# Altium schematic sheet Connector_SOM240_2.SchDoc: =SheetTitle_Top
size 420 x 297 mm; EDA_Number: ARTIQ; Author: G.Kasprowicz; CompanyName: WUT ISE; DrawnBy: G.Kasprowicz; Organization: WUT ISE; Address1: PW ISE; Address2: Nowowiejska 15/19 00-665 Warsaw; Address3: gkasprow@gmail.com; ModifiedBy: -; CheckedDate: -; Title2: K26 SOM240_2 Connector; DivGrp: WUT ISE; Designer: G.Kasprowicz; ModifiedDate: -; ProjectName: Sensor Box
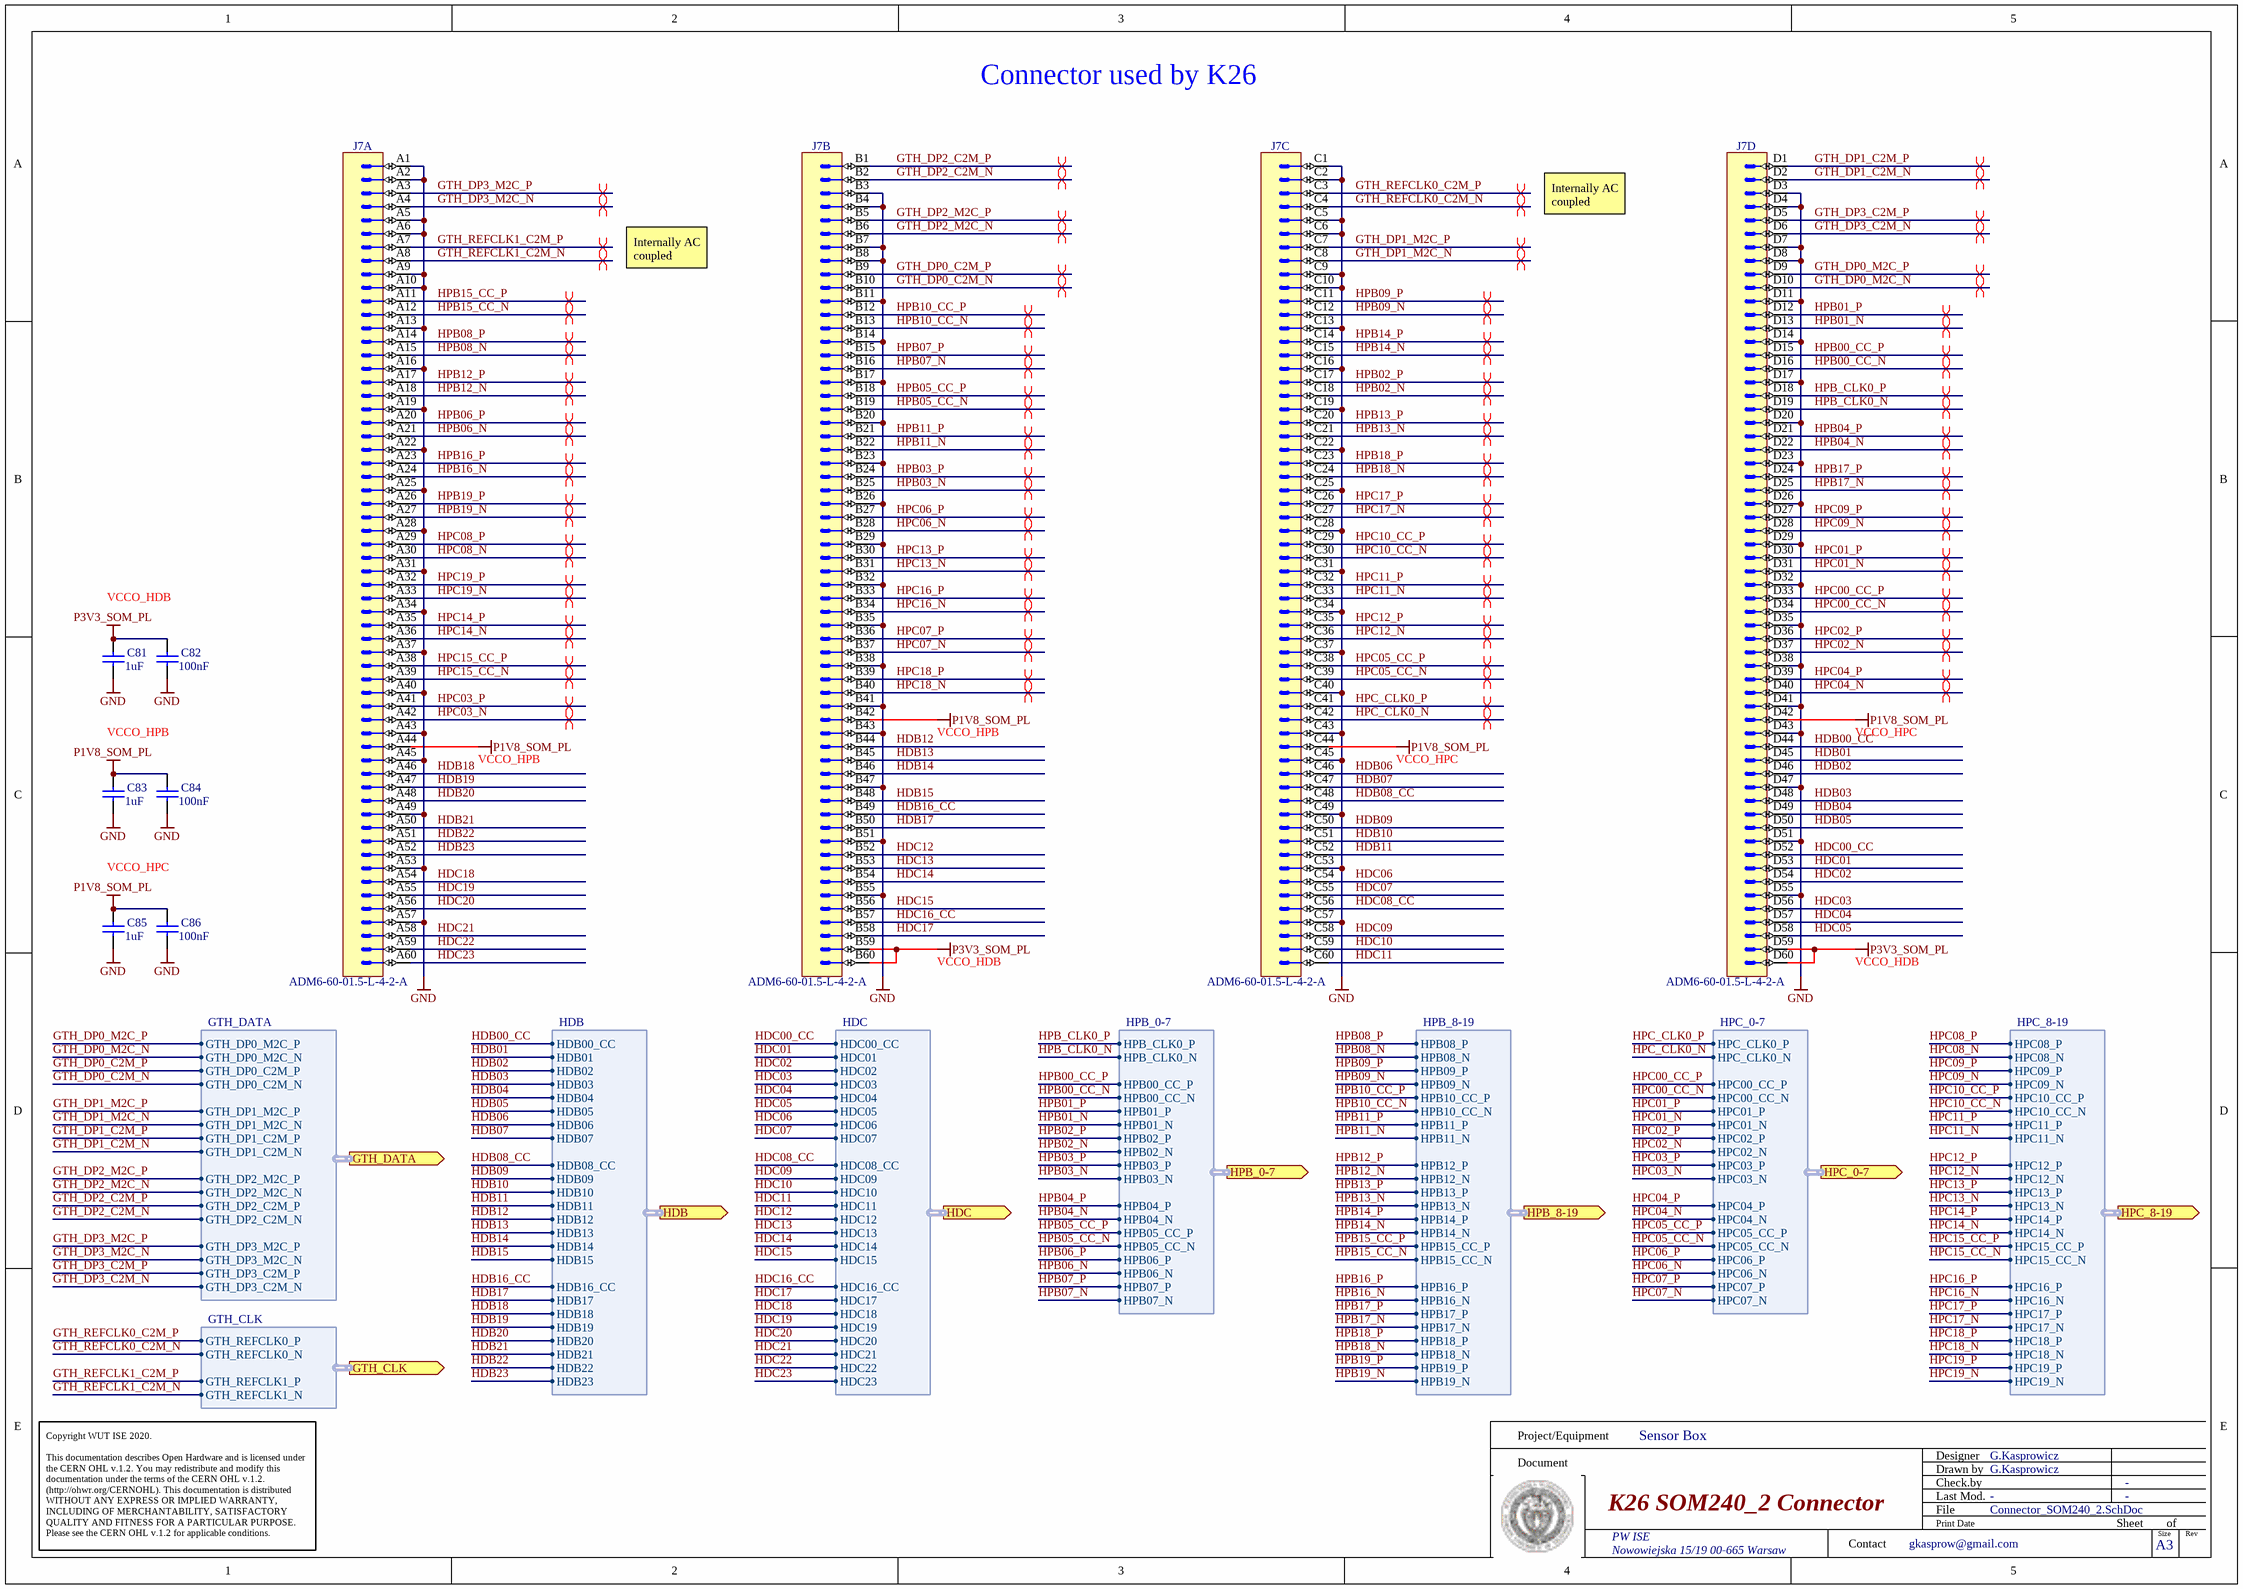
[diagram p0: Connector_SOM240_2.SchDoc]

## Parts
C81  1uF  [CAPC1005X55N]
C82  100nF  [CAPC1005X55N]
C83  1uF  [CAPC1005X55N]
C84  100nF  [CAPC1005X55N]
C85  1uF  [CAPC1005X55N]
C86  100nF  [CAPC1005X55N]
J7  Manufacturer Part Number: ADM6-60-01.5-L-4-2-A  [SAMTEC_ADM6-60-01.5-L-4-2-A]  (hidden comment: Header 240)  (parts A,B,C,D of 4)

## Ports
GTH_CLK (out, harness GTH_CLK), GTH_DATA (out, harness GTH_DATA), HDB (out, harness HDB), HDC (out, harness HDC), HPB_0-7 (out, harness HPB_0-7), HPB_8-19 (out, harness HPB_8-19), HPC_0-7 (out, harness HPC_0-7), HPC_8-19 (out, harness HPC_8-19)

## Harnesses
HDC: HDC00_CC, HDC01, HDC02, HDC03, HDC04, HDC05, HDC06, HDC07, HDC08_CC, HDC09, HDC10, HDC11, HDC12, HDC13, HDC14, HDC15, HDC16_CC, HDC17, HDC18, HDC19, HDC20, HDC21, HDC22, HDC23
HDB: HDB00_CC, HDB01, HDB02, HDB03, HDB04, HDB05, HDB06, HDB07, HDB08_CC, HDB09, HDB10, HDB11, HDB12, HDB13, HDB14, HDB15, HDB16_CC, HDB17, HDB18, HDB19, HDB20, HDB21, HDB22, HDB23
GTH_DATA: GTH_DP0_M2C_P, GTH_DP0_M2C_N, GTH_DP0_C2M_P, GTH_DP0_C2M_N, GTH_DP1_M2C_P, GTH_DP1_M2C_N, GTH_DP1_C2M_P, GTH_DP1_C2M_N, GTH_DP2_M2C_P, GTH_DP2_M2C_N, GTH_DP2_C2M_P, GTH_DP2_C2M_N, GTH_DP3_M2C_P, GTH_DP3_M2C_N, GTH_DP3_C2M_P, GTH_DP3_C2M_N
GTH_CLK: GTH_REFCLK0_P, GTH_REFCLK0_N, GTH_REFCLK1_P, GTH_REFCLK1_N
HPB_0-7: HPB_CLK0_P, HPB_CLK0_N, HPB00_CC_P, HPB00_CC_N, HPB01_P, HPB01_N, HPB02_P, HPB02_N, HPB03_P, HPB03_N, HPB04_P, HPB04_N, HPB05_CC_P, HPB05_CC_N, HPB06_P, HPB06_N, HPB07_P, HPB07_N
HPB_8-19: HPB08_P, HPB08_N, HPB09_P, HPB09_N, HPB10_CC_P, HPB10_CC_N, HPB11_P, HPB11_N, HPB12_P, HPB12_N, HPB13_P, HPB13_N, HPB14_P, HPB14_N, HPB15_CC_P, HPB15_CC_N, HPB16_P, HPB16_N, HPB17_P, HPB17_N, HPB18_P, HPB18_N, HPB19_P, HPB19_N
HPC_0-7: HPC_CLK0_P, HPC_CLK0_N, HPC00_CC_P, HPC00_CC_N, HPC01_P, HPC01_N, HPC02_P, HPC02_N, HPC03_P, HPC03_N, HPC04_P, HPC04_N, HPC05_CC_P, HPC05_CC_N, HPC06_P, HPC06_N, HPC07_P, HPC07_N
HPC_8-19: HPC08_P, HPC08_N, HPC09_P, HPC09_N, HPC10_CC_P, HPC10_CC_N, HPC11_P, HPC11_N, HPC12_P, HPC12_N, HPC13_P, HPC13_N, HPC14_P, HPC14_N, HPC15_CC_P, HPC15_CC_N, HPC16_P, HPC16_N, HPC17_P, HPC17_N, HPC18_P, HPC18_N, HPC19_P, HPC19_N

## Nets
GND: C81.1 C82.1 C83.1 C84.1 C85.1 C86.1 J7.A1 J7.A2 J7.A5 J7.A6 J7.A9 J7.A10 J7.A13 J7.A16 J7.A19 J7.A22 J7.A25 J7.A28 J7.A31 J7.A34 J7.A37 J7.A40 J7.A43 J7.A45 J7.A49 J7.A53 J7.A57 J7.B3 J7.B4 J7.B7 J7.B8 J7.B11 J7.B14 J7.B17 J7.B20 J7.B23 J7.B26 J7.B29 J7.B32 J7.B35 J7.B38 J7.B41 J7.B43 J7.B47 J7.B51 J7.B55 J7.C1 J7.C2 J7.C5 J7.C6 J7.C9 J7.C10 J7.C13 J7.C16 J7.C19 J7.C22 J7.C25 J7.C28 J7.C31 J7.C34 J7.C37 J7.C40 J7.C43 J7.C45 J7.C49 J7.C53 J7.C57 J7.D3 J7.D4 J7.D7 J7.D8 J7.D11 J7.D14 J7.D17 J7.D20 J7.D23 J7.D26 J7.D29 J7.D32 J7.D35 J7.D38 J7.D41 J7.D43 J7.D47 J7.D51 J7.D55
P1V8_SOM_PL: C83.2 C84.2 C85.2 C86.2 J7.A44 J7.B42 J7.C44 J7.D42
P3V3_SOM_PL: C81.2 C82.2 J7.B59 J7.B60 J7.D59 J7.D60
GTH_DP0_C2M_N: J7.B10 ; port GTH_DATA.GTH_DP0_C2M_N
GTH_DP0_C2M_P: J7.B9 ; port GTH_DATA.GTH_DP0_C2M_P
GTH_DP0_M2C_N: J7.D10 ; port GTH_DATA.GTH_DP0_M2C_N
GTH_DP0_M2C_P: J7.D9 ; port GTH_DATA.GTH_DP0_M2C_P
GTH_DP1_C2M_N: J7.D2 ; port GTH_DATA.GTH_DP1_C2M_N
GTH_DP1_C2M_P: J7.D1 ; port GTH_DATA.GTH_DP1_C2M_P
GTH_DP1_M2C_N: J7.C8 ; port GTH_DATA.GTH_DP1_M2C_N
GTH_DP1_M2C_P: J7.C7 ; port GTH_DATA.GTH_DP1_M2C_P
GTH_DP2_C2M_N: J7.B2 ; port GTH_DATA.GTH_DP2_C2M_N
GTH_DP2_C2M_P: J7.B1 ; port GTH_DATA.GTH_DP2_C2M_P
GTH_DP2_M2C_N: J7.B6 ; port GTH_DATA.GTH_DP2_M2C_N
GTH_DP2_M2C_P: J7.B5 ; port GTH_DATA.GTH_DP2_M2C_P
GTH_DP3_C2M_N: J7.D6 ; port GTH_DATA.GTH_DP3_C2M_N
GTH_DP3_C2M_P: J7.D5 ; port GTH_DATA.GTH_DP3_C2M_P
GTH_DP3_M2C_N: J7.A4 ; port GTH_DATA.GTH_DP3_M2C_N
GTH_DP3_M2C_P: J7.A3 ; port GTH_DATA.GTH_DP3_M2C_P
GTH_REFCLK0_C2M_N: J7.C4 ; port GTH_CLK.GTH_REFCLK0_N
GTH_REFCLK0_C2M_P: J7.C3 ; port GTH_CLK.GTH_REFCLK0_P
GTH_REFCLK1_C2M_N: J7.A8 ; port GTH_CLK.GTH_REFCLK1_N
GTH_REFCLK1_C2M_P: J7.A7 ; port GTH_CLK.GTH_REFCLK1_P
HDB00_CC: J7.D44 ; port HDB.HDB00_CC
HDB01: J7.D45 ; port HDB.HDB01
HDB02: J7.D46 ; port HDB.HDB02
HDB03: J7.D48 ; port HDB.HDB03
HDB04: J7.D49 ; port HDB.HDB04
HDB05: J7.D50 ; port HDB.HDB05
HDB06: J7.C46 ; port HDB.HDB06
HDB07: J7.C47 ; port HDB.HDB07
HDB08_CC: J7.C48 ; port HDB.HDB08_CC
HDB09: J7.C50 ; port HDB.HDB09
HDB10: J7.C51 ; port HDB.HDB10
HDB11: J7.C52 ; port HDB.HDB11
HDB12: J7.B44 ; port HDB.HDB12
HDB13: J7.B45 ; port HDB.HDB13
HDB14: J7.B46 ; port HDB.HDB14
HDB15: J7.B48 ; port HDB.HDB15
HDB16_CC: J7.B49 ; port HDB.HDB16_CC
HDB17: J7.B50 ; port HDB.HDB17
HDB18: J7.A46 ; port HDB.HDB18
HDB19: J7.A47 ; port HDB.HDB19
HDB20: J7.A48 ; port HDB.HDB20
HDB21: J7.A50 ; port HDB.HDB21
HDB22: J7.A51 ; port HDB.HDB22
HDB23: J7.A52 ; port HDB.HDB23
HDC00_CC: J7.D52 ; port HDC.HDC00_CC
HDC01: J7.D53 ; port HDC.HDC01
HDC02: J7.D54 ; port HDC.HDC02
HDC03: J7.D56 ; port HDC.HDC03
HDC04: J7.D57 ; port HDC.HDC04
HDC05: J7.D58 ; port HDC.HDC05
HDC06: J7.C54 ; port HDC.HDC06
HDC07: J7.C55 ; port HDC.HDC07
HDC08_CC: J7.C56 ; port HDC.HDC08_CC
HDC09: J7.C58 ; port HDC.HDC09
HDC10: J7.C59 ; port HDC.HDC10
HDC11: J7.C60 ; port HDC.HDC11
HDC12: J7.B52 ; port HDC.HDC12
HDC13: J7.B53 ; port HDC.HDC13
HDC14: J7.B54 ; port HDC.HDC14
HDC15: J7.B56 ; port HDC.HDC15
HDC16_CC: J7.B57 ; port HDC.HDC16_CC
HDC17: J7.B58 ; port HDC.HDC17
HDC18: J7.A54 ; port HDC.HDC18
HDC19: J7.A55 ; port HDC.HDC19
HDC20: J7.A56 ; port HDC.HDC20
HDC21: J7.A58 ; port HDC.HDC21
HDC22: J7.A59 ; port HDC.HDC22
HDC23: J7.A60 ; port HDC.HDC23
HPB00_CC_N: J7.D16 ; port HPB_0-7.HPB00_CC_N
HPB00_CC_P: J7.D15 ; port HPB_0-7.HPB00_CC_P
HPB01_N: J7.D13 ; port HPB_0-7.HPB01_N
HPB01_P: J7.D12 ; port HPB_0-7.HPB01_P
HPB02_N: J7.C18 ; port HPB_0-7.HPB02_N
HPB02_P: J7.C17 ; port HPB_0-7.HPB02_P
HPB03_N: J7.B25 ; port HPB_0-7.HPB03_N
HPB03_P: J7.B24 ; port HPB_0-7.HPB03_P
HPB04_N: J7.D22 ; port HPB_0-7.HPB04_N
HPB04_P: J7.D21 ; port HPB_0-7.HPB04_P
HPB05_CC_N: J7.B19 ; port HPB_0-7.HPB05_CC_N
HPB05_CC_P: J7.B18 ; port HPB_0-7.HPB05_CC_P
HPB06_N: J7.A21 ; port HPB_0-7.HPB06_N
HPB06_P: J7.A20 ; port HPB_0-7.HPB06_P
HPB07_N: J7.B16 ; port HPB_0-7.HPB07_N
HPB07_P: J7.B15 ; port HPB_0-7.HPB07_P
HPB08_N: J7.A15 ; port HPB_8-19.HPB08_N
HPB08_P: J7.A14 ; port HPB_8-19.HPB08_P
HPB09_N: J7.C12 ; port HPB_8-19.HPB09_N
HPB09_P: J7.C11 ; port HPB_8-19.HPB09_P
HPB10_CC_N: J7.B13 ; port HPB_8-19.HPB10_CC_N
HPB10_CC_P: J7.B12 ; port HPB_8-19.HPB10_CC_P
HPB11_N: J7.B22 ; port HPB_8-19.HPB11_N
HPB11_P: J7.B21 ; port HPB_8-19.HPB11_P
HPB12_N: J7.A18 ; port HPB_8-19.HPB12_N
HPB12_P: J7.A17 ; port HPB_8-19.HPB12_P
HPB13_N: J7.C21 ; port HPB_8-19.HPB13_N
HPB13_P: J7.C20 ; port HPB_8-19.HPB13_P
HPB14_N: J7.C15 ; port HPB_8-19.HPB14_N
HPB14_P: J7.C14 ; port HPB_8-19.HPB14_P
HPB15_CC_N: J7.A12 ; port HPB_8-19.HPB15_CC_N
HPB15_CC_P: J7.A11 ; port HPB_8-19.HPB15_CC_P
HPB16_N: J7.A24 ; port HPB_8-19.HPB16_N
HPB16_P: J7.A23 ; port HPB_8-19.HPB16_P
HPB17_N: J7.D25 ; port HPB_8-19.HPB17_N
HPB17_P: J7.D24 ; port HPB_8-19.HPB17_P
HPB18_N: J7.C24 ; port HPB_8-19.HPB18_N
HPB18_P: J7.C23 ; port HPB_8-19.HPB18_P
HPB19_N: J7.A27 ; port HPB_8-19.HPB19_N
HPB19_P: J7.A26 ; port HPB_8-19.HPB19_P
HPB_CLK0_N: J7.D19 ; port HPB_0-7.HPB_CLK0_N
HPB_CLK0_P: J7.D18 ; port HPB_0-7.HPB_CLK0_P
HPC00_CC_N: J7.D34 ; port HPC_0-7.HPC00_CC_N
HPC00_CC_P: J7.D33 ; port HPC_0-7.HPC00_CC_P
HPC01_N: J7.D31 ; port HPC_0-7.HPC01_N
HPC01_P: J7.D30 ; port HPC_0-7.HPC01_P
HPC02_N: J7.D37 ; port HPC_0-7.HPC02_N
HPC02_P: J7.D36 ; port HPC_0-7.HPC02_P
HPC03_N: J7.A42 ; port HPC_0-7.HPC03_N
HPC03_P: J7.A41 ; port HPC_0-7.HPC03_P
HPC04_N: J7.D40 ; port HPC_0-7.HPC04_N
HPC04_P: J7.D39 ; port HPC_0-7.HPC04_P
HPC05_CC_N: J7.C39 ; port HPC_0-7.HPC05_CC_N
HPC05_CC_P: J7.C38 ; port HPC_0-7.HPC05_CC_P
HPC06_N: J7.B28 ; port HPC_0-7.HPC06_N
HPC06_P: J7.B27 ; port HPC_0-7.HPC06_P
HPC07_N: J7.B37 ; port HPC_0-7.HPC07_N
HPC07_P: J7.B36 ; port HPC_0-7.HPC07_P
HPC08_N: J7.A30 ; port HPC_8-19.HPC08_N
HPC08_P: J7.A29 ; port HPC_8-19.HPC08_P
HPC09_N: J7.D28 ; port HPC_8-19.HPC09_N
HPC09_P: J7.D27 ; port HPC_8-19.HPC09_P
HPC10_CC_N: J7.C30 ; port HPC_8-19.HPC10_CC_N
HPC10_CC_P: J7.C29 ; port HPC_8-19.HPC10_CC_P
HPC11_N: J7.C33 ; port HPC_8-19.HPC11_N
HPC11_P: J7.C32 ; port HPC_8-19.HPC11_P
HPC12_N: J7.C36 ; port HPC_8-19.HPC12_N
HPC12_P: J7.C35 ; port HPC_8-19.HPC12_P
HPC13_N: J7.B31 ; port HPC_8-19.HPC13_N
HPC13_P: J7.B30 ; port HPC_8-19.HPC13_P
HPC14_N: J7.A36 ; port HPC_8-19.HPC14_N
HPC14_P: J7.A35 ; port HPC_8-19.HPC14_P
HPC15_CC_N: J7.A39 ; port HPC_8-19.HPC15_CC_N
HPC15_CC_P: J7.A38 ; port HPC_8-19.HPC15_CC_P
HPC16_N: J7.B34 ; port HPC_8-19.HPC16_N
HPC16_P: J7.B33 ; port HPC_8-19.HPC16_P
HPC17_N: J7.C27 ; port HPC_8-19.HPC17_N
HPC17_P: J7.C26 ; port HPC_8-19.HPC17_P
HPC18_N: J7.B40 ; port HPC_8-19.HPC18_N
HPC18_P: J7.B39 ; port HPC_8-19.HPC18_P
HPC19_N: J7.A33 ; port HPC_8-19.HPC19_N
HPC19_P: J7.A32 ; port HPC_8-19.HPC19_P
HPC_CLK0_N: J7.C42 ; port HPC_0-7.HPC_CLK0_N
HPC_CLK0_P: J7.C41 ; port HPC_0-7.HPC_CLK0_P

## Layout directives
differential pair; differential pair class Diff_GTH: GTH_DP0_C2M_N, GTH_DP0_C2M_P, GTH_DP0_M2C_N, GTH_DP0_M2C_P, GTH_DP1_C2M_N, GTH_DP1_C2M_P, GTH_DP1_M2C_N, GTH_DP1_M2C_P, GTH_DP2_C2M_N, GTH_DP2_C2M_P, GTH_DP2_M2C_N, GTH_DP2_M2C_P, GTH_DP3_C2M_N, GTH_DP3_C2M_P, GTH_DP3_M2C_N, GTH_DP3_M2C_P, GTH_REFCLK0_C2M_N, GTH_REFCLK0_C2M_P, GTH_REFCLK1_C2M_N, GTH_REFCLK1_C2M_P
differential pair; differential pair class Diff_HPB: HPB00_CC_N, HPB00_CC_P, HPB01_N, HPB01_P, HPB02_N, HPB02_P, HPB03_N, HPB03_P, HPB04_N, HPB04_P, HPB05_CC_N, HPB05_CC_P, HPB06_N, HPB06_P, HPB07_N, HPB07_P, HPB08_N, HPB08_P, HPB09_N, HPB09_P, HPB10_CC_N, HPB10_CC_P, HPB11_N, HPB11_P, HPB12_N, HPB12_P, HPB13_N, HPB13_P, HPB14_N, HPB14_P, HPB15_CC_N, HPB15_CC_P, HPB16_N, HPB16_P, HPB17_N, HPB17_P, HPB18_N, HPB18_P, HPB19_N, HPB19_P, HPB_CLK0_N, HPB_CLK0_P
differential pair; differential pair class Diff_HPC: HPC00_CC_N, HPC00_CC_P, HPC01_N, HPC01_P, HPC02_N, HPC02_P, HPC03_N, HPC03_P, HPC04_N, HPC04_P, HPC05_CC_N, HPC05_CC_P, HPC06_N, HPC06_P, HPC07_N, HPC07_P, HPC08_N, HPC08_P, HPC09_N, HPC09_P, HPC10_CC_N, HPC10_CC_P, HPC11_N, HPC11_P, HPC12_N, HPC12_P, HPC13_N, HPC13_P, HPC14_N, HPC14_P, HPC15_CC_N, HPC15_CC_P, HPC16_N, HPC16_P, HPC17_N, HPC17_P, HPC18_N, HPC18_P, HPC19_N, HPC19_P, HPC_CLK0_N, HPC_CLK0_P

## Notes on the sheet
- Connector used by K26
- Internally AC coupled
- VCCO_HDB
- VCCO_HPB
- VCCO_HPC
- Project/Equipment
- Document
- Designer
- Drawn by
- Check.by
- Copyright WUT ISE 2020.
  This documentation describes Open Hardware and is licensed under the CERN OHL v.1.2. You may redistribute and modify this documentation under the terms of the CERN OHL v.1.2. (http://ohwr.org/CERNOHL). This documentation is distributed WITHOUT ANY EXPRESS OR IMPLIED WARRANTY, INCLUDING OF MERCHANTABILITY, SATISFACTORY QUALITY AND FITNESS FOR A PARTICULAR PURPOSE. Please see the CERN OHL v.1.2 for applicable conditions.
- Contact
- File
- Last Mod.
- Print Date
- Sheet
- Size
- A3
- of
- Rev

## Library data of the parts
C81 C83 C85 = CC0402_1UF_16V_10%_X5R: Non-polarised capacitor; Part Description: SMD Multilayer Chip Ceramic Capacitor; Manufacturer: GENERIC; Manufacturer1 Part Number: C1005X5R1C105KT; Voltage: 16V; TC: X5R; Tolerance: ±10%; Part Number: CC0402_1UF_16V_10%_X5R; Component Kind: Standard; Component Type: Standard; Pin Count: 2; Value: 1uF; Status: Preferred; Manufacturer Part Number: CC0402_1UF_16V_10%_X5R; Case: 0402; Mounted: Yes; Socket: No; SMD: Yes; Sense: No; Manufacturer1 Example: TDK; Manufacturer1 ComponentHeight: 0.55mm; HelpURL: \\cern.ch\dfs\Applications\Altium\Datasheets\CC0402_X5R_TDK_C.pdf; Author: CERN DEM JLC; CreateDate: 2012-10-25; LatestRevisionDate: 2012-10-25
C82 C84 C86 = CC0402_100NF_16V_10%_X5R: Non-polarised capacitor; Part Description: SMD Multilayer Chip Ceramic Capacitor; Manufacturer: GENERIC; Manufacturer1 Part Number: GRM155R61C104KA88D; Voltage: 16V; TC: X5R; Tolerance: ±10%; Part Number: CC0402_100NF_16V_10%_X5R; Component Kind: Standard; Component Type: Standard; Pin Count: 2; Value: 100nF; Status: None; Manufacturer Part Number: CC0402_100NF_16V_10%_X5R; Case: 0402; Mounted: Yes; Socket: No; SMD: Yes; Sense: No; Manufacturer1 Example: MURATA; Manufacturer1 ComponentHeight: 0.55mm; HelpURL: \\cern.ch\dfs\Applications\Altium\Datasheets\CC0402_X5R_MURATA_GRM.pdf; Author: CERN DEM JLC; CreateDate: 10.12.2013; LatestRevisionDate: 10.12.2013
J7 = SAMTEC_ADM6-60-01.5-L-4-2-A: Connector 240 Male contacts in 4 row abcd; Part Description: 240 contacts (4 rows abcd) High-Density  Slim Body Arrays Male Connector; Manufacturer: SAMTEC; PressFit: No; Part Number: SAMTEC_ADM6-60-01.5-L-4-2-A; Component Kind: Standard; Component Type: Standard; Pin Count: 240; Family: Header 240; Mounted: Yes; Socket: No; SMD: Yes; Sense: No; Status: None; ComponentHeight: 4.1mm; HelpURL: \\cern.ch\dfs\Applications\Altium\Datasheets\SAMTEC_ADM6-60-01.5-L-4-2-A.pdf; Author: CERN DEM HF; CreateDate: 27/10/2021; LatestRevisionDate: 11/01/2022